# EAGLE design DAQ32 (EAGLE 5.10)
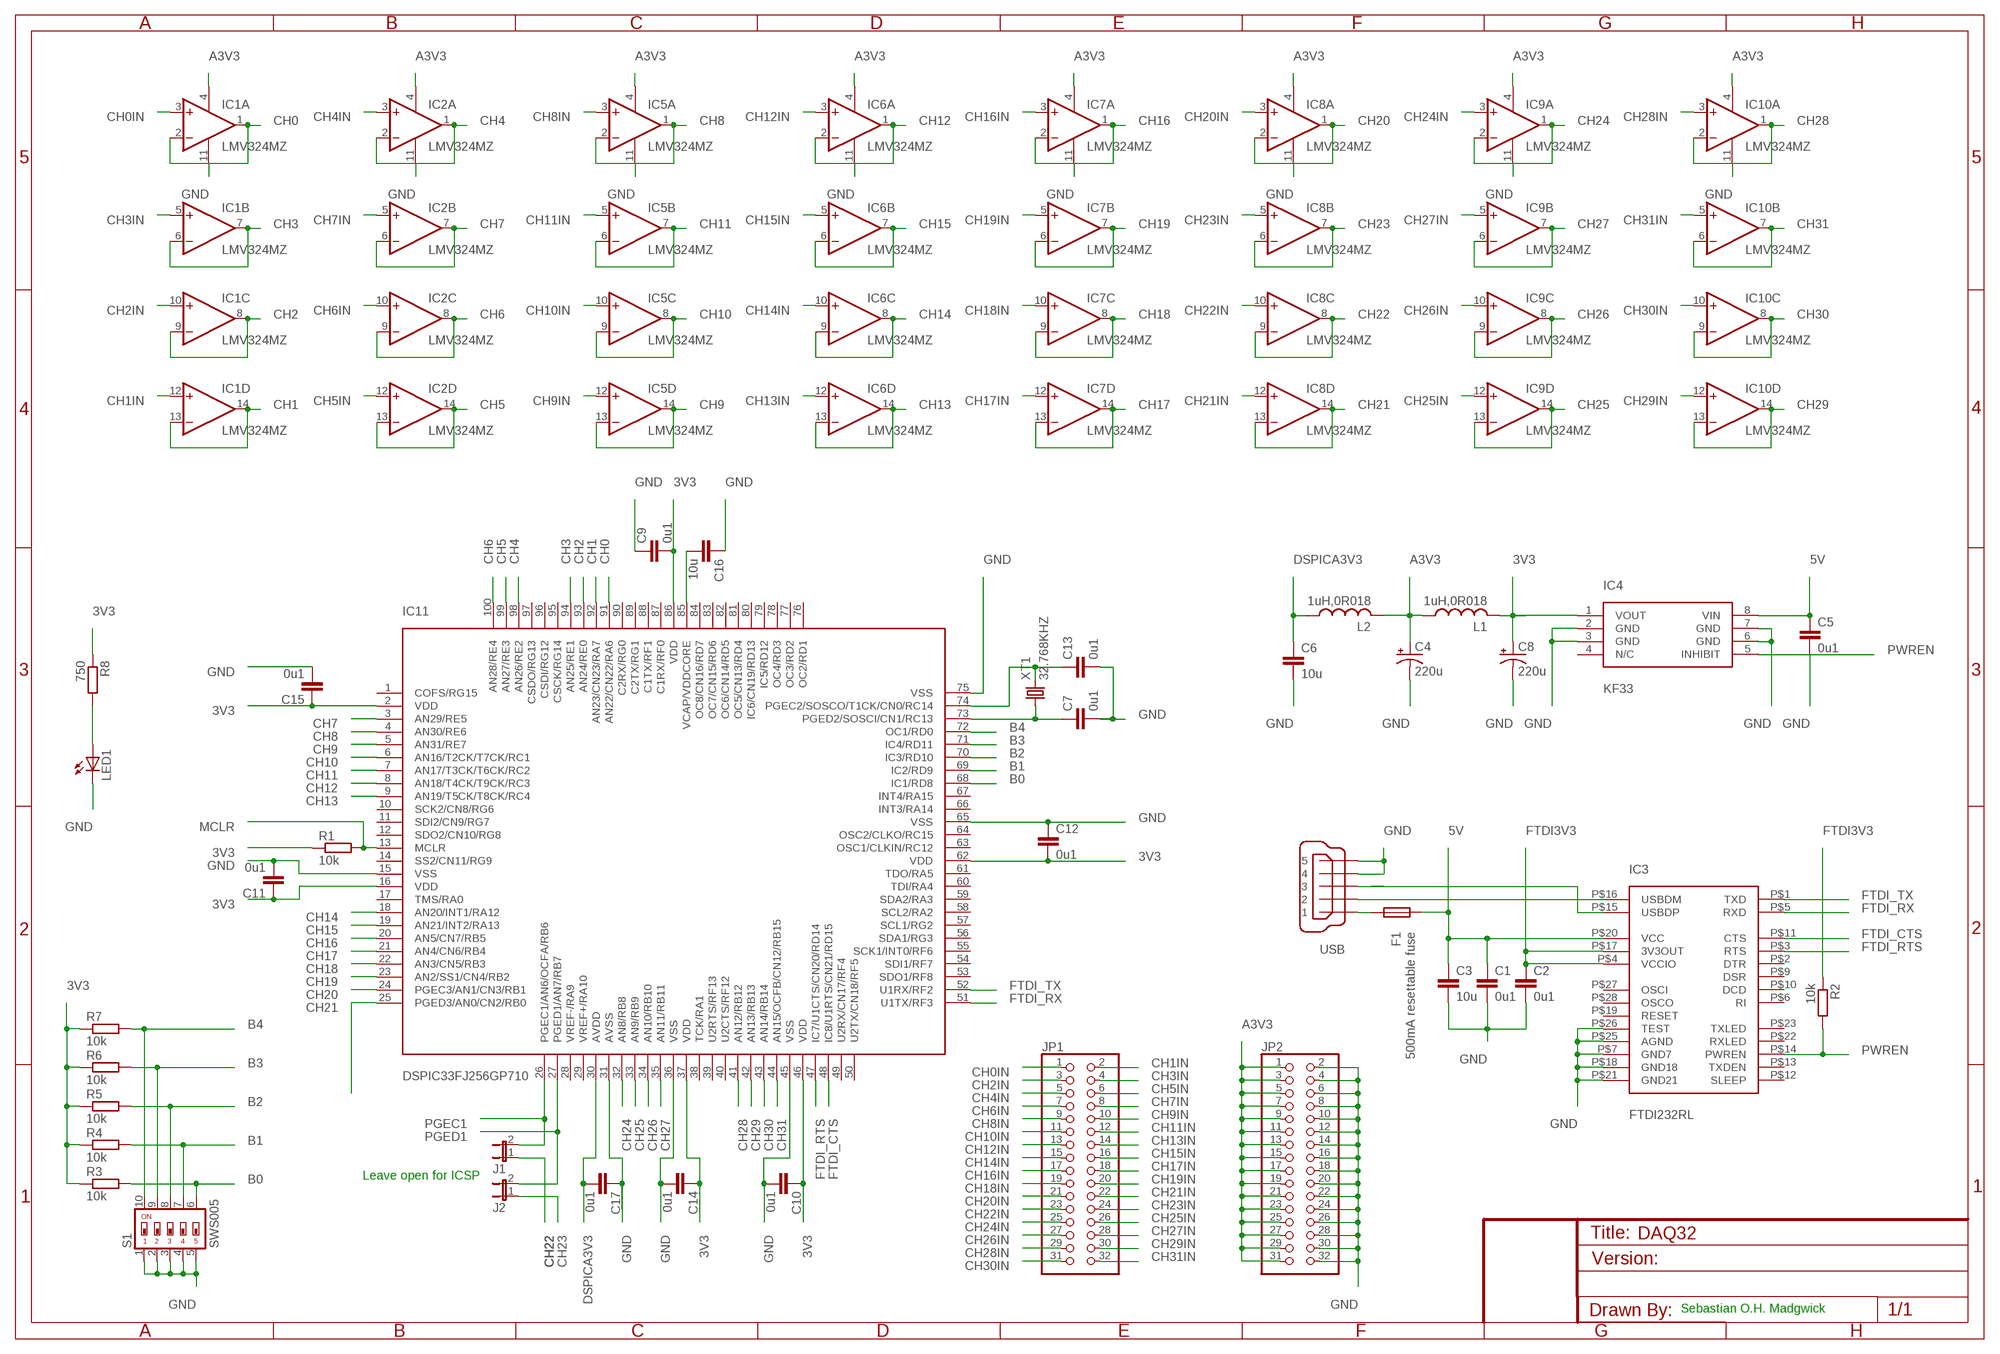
[diagram p0: schematic, sheet 1]

## Parts
C1  0u1  CAP0603-CAP  [0603-CAP]
C2  0u1  CAP0603-CAP  [0603-CAP]
C3  10u  CAP0603-CAP  [0603-CAP]
C4  220u  CPOL-USD  [PANASONIC_D]
C5  0u1  CAP0603-CAP  [0603-CAP]
C6  10u  CAP0603-CAP  [0603-CAP]
C7  0u1  CAP0603-CAP  [0603-CAP]
C8  220u  CPOL-USD  [PANASONIC_D]
C9  0u1  CAP0603-CAP  [0603-CAP]
C10  0u1  CAP0603-CAP  [0603-CAP]
C11  0u1  CAP0603-CAP  [0603-CAP]
C12  0u1  CAP0603-CAP  [0603-CAP]
C13  0u1  CAP0603-CAP  [0603-CAP]
C14  0u1  CAP0603-CAP  [0603-CAP]
C15  0u1  CAP0603-CAP  [0603-CAP]
C16  10u  CAP0603-CAP  [0603-CAP]
C17  0u1  CAP0603-CAP  [0603-CAP]
F1  500mA resettable fuse  R-EU_R1206  [R1206]
IC1  LMV324MZ  [TSSOP14]
IC2  LMV324MZ  [TSSOP14]
IC3  FTDI232RL  [SSOP28]
IC4  KF33  [SO-08]
IC5  LMV324MZ  [TSSOP14]
IC6  LMV324MZ  [TSSOP14]
IC7  LMV324MZ  [TSSOP14]
IC8  LMV324MZ  [TSSOP14]
IC9  LMV324MZ  [TSSOP14]
IC10  LMV324MZ  [TSSOP14]
IC11  DSPIC33FJ256GP710  [TQFP-100]
J1  JUMPER-2SMD-NO  [SJ_2S-NO]
J2  JUMPER-2SMD-NO  [SJ_2S-NO]
JP1  PINHD-2X16  [2X16]
JP2  PINHD-2X16  [2X16]
L1  1uH,0R018  L-USPIS2816  [PIS2816]
L2  1uH,0R018  L-USPIS2816  [PIS2816]
LED1  LEDCHIPLED_0603  [CHIPLED_0603]
R1  10k  R-EU_R0603  [R0603]
R2  10k  R-EU_R0603  [R0603]
R3  10k  R-EU_R0603  [R0603]
R4  10k  R-EU_R0603  [R0603]
R5  10k  R-EU_R0603  [R0603]
R6  10k  R-EU_R0603  [R0603]
R7  10k  R-EU_R0603  [R0603]
R8  750  R-EU_R0603  [R0603]
S1  SWS005  [SMS-005]
USB  MINI-USB-UX60A-MB-5ST  [UX60A-MB-5ST]
XT1  32.768KHZ  TUNINGFORKCRYSTAL32.768KHZ  [TUNINGFORKCRYSTAL32.768KHZ]

## Nets
3V3: C8.+ C9.2 C10.1 C11.1 C12.2 C14.1 C15.1 IC4.1(VOUT) IC11.2(VDD) IC11.16(VDD) IC11.37(VDD) IC11.46(VDD) IC11.62(VDD) IC11.86(VDD) L1.2 R1.1 R3.1 R4.1 R5.1 R6.1 R7.1 R8.1
5V: C1.1 C3.1 C5.1 F1.2 IC3.P$20(VCC) IC4.8(VIN)
A3V3: C4.+ IC1.4(P:V+) IC2.4(P:V+) IC5.4(P:V+) IC6.4(P:V+) IC7.4(P:V+) IC8.4(P:V+) IC9.4(P:V+) IC10.4(P:V+) JP2.1 JP2.3 JP2.5 JP2.7 JP2.9 JP2.11 JP2.13 JP2.15 JP2.17 JP2.19 JP2.21 JP2.23 JP2.25 JP2.27 JP2.29 JP2.31 L1.1 L2.2
B0: IC11.68(IC1/RD8) R3.2 S1.6
B1: IC11.69(IC2/RD9) R4.2 S1.7
B2: IC11.70(IC3/RD10) R5.2 S1.8
B3: IC11.71(IC4/RD11) R6.2 S1.9
B4: IC11.72(OC1/RD0) R7.2 S1.10
CH0: IC1.1(A:OUT) IC1.2(A:-IN) IC11.91(AN22/CN22/RA6)
CH0IN: IC1.3(A:+IN) JP1.1
CH1: IC1.13(D:-IN) IC1.14(D:OUT) IC11.92(AN23/CN23/RA7)
CH1IN: IC1.12(D:+IN) JP1.2
CH2: IC1.8(C:OUT) IC1.9(C:-IN) IC11.93(AN24/RE0)
CH2IN: IC1.10(C:+IN) JP1.3
CH3: IC1.6(B:-IN) IC1.7(B:OUT) IC11.94(AN25/RE1)
CH3IN: IC1.5(B:+IN) JP1.4
CH4: IC2.1(A:OUT) IC2.2(A:-IN) IC11.98(AN26/RE2)
CH4IN: IC2.3(A:+IN) JP1.5
CH5: IC2.13(D:-IN) IC2.14(D:OUT) IC11.99(AN27/RE3)
CH5IN: IC2.12(D:+IN) JP1.6
CH6: IC2.8(C:OUT) IC2.9(C:-IN) IC11.100(AN28/RE4)
CH6IN: IC2.10(C:+IN) JP1.7
CH7: IC2.6(B:-IN) IC2.7(B:OUT) IC11.3(AN29/RE5)
CH7IN: IC2.5(B:+IN) JP1.8
CH8: IC5.1(A:OUT) IC5.2(A:-IN) IC11.4(AN30/RE6)
CH8IN: IC5.3(A:+IN) JP1.9
CH9: IC5.13(D:-IN) IC5.14(D:OUT) IC11.5(AN31/RE7)
CH9IN: IC5.12(D:+IN) JP1.10
CH10: IC5.8(C:OUT) IC5.9(C:-IN) IC11.6(AN16/T2CK/T7CK/RC1)
CH10IN: IC5.10(C:+IN) JP1.11
CH11: IC5.6(B:-IN) IC5.7(B:OUT) IC11.7(AN17/T3CK/T6CK/RC2)
CH11IN: IC5.5(B:+IN) JP1.12
CH12: IC6.1(A:OUT) IC6.2(A:-IN) IC11.8(AN18/T4CK/T9CK/RC3)
CH12IN: IC6.3(A:+IN) JP1.13
CH13: IC6.13(D:-IN) IC6.14(D:OUT) IC11.9(AN19/T5CK/T8CK/RC4)
CH13IN: IC6.12(D:+IN) JP1.14
CH14: IC6.8(C:OUT) IC6.9(C:-IN) IC11.18(AN20/INT1/RA12)
CH14IN: IC6.10(C:+IN) JP1.15
CH15: IC6.6(B:-IN) IC6.7(B:OUT) IC11.19(AN21/INT2/RA13)
CH15IN: IC6.5(B:+IN) JP1.16
CH16: IC7.1(A:OUT) IC7.2(A:-IN) IC11.20(AN5/CN7/RB5)
CH16IN: IC7.3(A:+IN) JP1.17
CH17: IC7.13(D:-IN) IC7.14(D:OUT) IC11.21(AN4/CN6/RB4)
CH17IN: IC7.12(D:+IN) JP1.18
CH18: IC7.8(C:OUT) IC7.9(C:-IN) IC11.22(AN3/CN5/RB3)
CH18IN: IC7.10(C:+IN) JP1.19
CH19: IC7.6(B:-IN) IC7.7(B:OUT) IC11.23(AN2/SS1/CN4/RB2)
CH19IN: IC7.5(B:+IN) JP1.20
CH20: IC8.1(A:OUT) IC8.2(A:-IN) IC11.24(PGEC3/AN1/CN3/RB1)
CH20IN: IC8.3(A:+IN) JP1.21
CH21: IC8.13(D:-IN) IC8.14(D:OUT) IC11.25(PGED3/AN0/CN2/RB0)
CH21IN: IC8.12(D:+IN) JP1.22
CH22: IC8.8(C:OUT) IC8.9(C:-IN) J1.1
CH22IN: IC8.10(C:+IN) JP1.23
CH23: IC8.6(B:-IN) IC8.7(B:OUT) J2.1
CH23IN: IC8.5(B:+IN) JP1.24
CH24: IC9.1(A:OUT) IC9.2(A:-IN) IC11.32(AN8/RB8)
CH24IN: IC9.3(A:+IN) JP1.25
CH25: IC9.13(D:-IN) IC9.14(D:OUT) IC11.33(AN9/RB9)
CH25IN: IC9.12(D:+IN) JP1.26
CH26: IC9.8(C:OUT) IC9.9(C:-IN) IC11.34(AN10/RB10)
CH26IN: IC9.10(C:+IN) JP1.27
CH27: IC9.6(B:-IN) IC9.7(B:OUT) IC11.35(AN11/RB11)
CH27IN: IC9.5(B:+IN) JP1.28
CH28: IC10.1(A:OUT) IC10.2(A:-IN) IC11.41(AN12/RB12)
CH28IN: IC10.3(A:+IN) JP1.29
CH29: IC10.13(D:-IN) IC10.14(D:OUT) IC11.42(AN13/RB13)
CH29IN: IC10.12(D:+IN) JP1.30
CH30: IC10.8(C:OUT) IC10.9(C:-IN) IC11.43(AN14/RB14)
CH30IN: IC10.10(C:+IN) JP1.31
CH31: IC10.6(B:-IN) IC10.7(B:OUT) IC11.44(AN15/OCFB/CN12/RB15)
CH31IN: IC10.5(B:+IN) JP1.32
D+: IC3.P$15(USBDP) USB.3
D-: IC3.P$16(USBDM) USB.2
DSPICA3V3: C6.1 C17.2 IC11.30(AVDD) L2.1
FTDI3V3: C2.1 IC3.P$4(VCCIO) IC3.P$17(3V3OUT) R2.1
FTDI_CTS: IC3.P$11(CTS) IC11.48(IC8/U1RTS/CN21/RD15)
FTDI_RTS: IC3.P$3(RTS) IC11.47(IC7/U1CTS/CN20/RD14)
FTDI_RX: IC3.P$5(RXD) IC11.51(U1TX/RF3)
FTDI_TX: IC3.P$1(TXD) IC11.52(U1RX/RF2)
GND: C1.2 C2.2 C3.2 C4.- C5.2 C6.2 C7.2 C8.- C9.1 C10.2 C11.2 C12.1 C13.2 C14.2 C15.2 C16.1 C17.1 IC1.11(P:V-) IC2.11(P:V-) IC3.P$7(GND7) IC3.P$18(GND18) IC3.P$21(GND21) IC3.P$25(AGND) IC3.P$26(TEST) IC4.2(GND) IC4.3(GND) IC4.6(GND) IC4.7(GND) IC5.11(P:V-) IC6.11(P:V-) IC7.11(P:V-) IC8.11(P:V-) IC9.11(P:V-) IC10.11(P:V-) IC11.15(VSS) IC11.31(AVSS) IC11.36(VSS) IC11.45(VSS) IC11.65(VSS) IC11.75(VSS) JP2.2 JP2.4 JP2.6 JP2.8 JP2.10 JP2.12 JP2.14 JP2.16 JP2.18 JP2.20 JP2.22 JP2.24 JP2.26 JP2.28 JP2.30 JP2.32 LED1.C S1.1 S1.2 S1.3 S1.4 S1.5 USB.4 USB.5
MCLR: IC11.13(MCLR) R1.2
N$2: F1.1 USB.1
N$3: LED1.A R8.2
N$15: C16.2 IC11.85(VCAP/VDDCORE)
N$17: C13.1 IC11.74(PGEC2/SOSCO/T1CK/CN0/RC14) XT1.P$2
N$18: C7.1 IC11.73(PGED2/SOSCI/CN1/RC13) XT1.P$1
PGEC1: IC11.26(PGEC1/AN6/OCFA/RB6) J1.2
PGED1: IC11.27(PGED1/AN7/RB7) J2.2
PWREN: IC3.P$14(PWREN) IC4.5(INHIBIT) R2.2
Unconnected: IC3.P$2(DTR) IC3.P$6(RI) IC3.P$9(DSR) IC3.P$10(DCD) IC3.P$12(SLEEP) IC3.P$13(TXDEN) IC3.P$19(RESET) IC3.P$22(RXLED) IC3.P$23(TXLED) IC3.P$27(OSCI) IC3.P$28(OSCO) IC4.4(N/C) IC11.1(COFS/RG15) IC11.10(SCK2/CN8/RG6) IC11.11(SDI2/CN9/RG7) IC11.12(SDO2/CN10/RG8) IC11.14(SS2/CN11/RG9) IC11.17(TMS/RA0) IC11.28(VREF-/RA9) IC11.29(VREF+/RA10) IC11.38(TCK/RA1) IC11.39(U2RTS/RF13) IC11.40(U2CTS/RF12) IC11.49(U2RX/CN17/RF4) IC11.50(U2TX/CN18/RF5) IC11.53(SDO1/RF8) IC11.54(SDI1/RF7) IC11.55(SCK1/INT0/RF6) IC11.56(SDA1/RG3) IC11.57(SCL1/RG2) IC11.58(SCL2/RA2) IC11.59(SDA2/RA3) IC11.60(TDI/RA4) IC11.61(TDO/RA5) IC11.63(OSC1/CLKIN/RC12) IC11.64(OSC2/CLKO/RC15) IC11.66(INT3/RA14) IC11.67(INT4/RA15) IC11.76(OC2/RD1) IC11.77(OC3/RD2) IC11.78(OC4/RD3) IC11.79(IC5/RD12) IC11.80(IC6/CN19/RD13) IC11.81(OC5/CN13/RD4) IC11.82(OC6/CN14/RD5) IC11.83(OC7/CN15/RD6) IC11.84(OC8/CN16/RD7) IC11.87(C1RX/RF0) IC11.88(C1TX/RF1) IC11.89(C2TX/RG1) IC11.90(C2RX/RG0) IC11.95(CSCK/RG14) IC11.96(CSDI/RG12) IC11.97(CSDO/RG13)

## Notes on the sheet
- Leave open for ICSP
- Sebastian O.H. Madgwick

## Library data of the parts
C1-C3 C5-C7 C9-C17 = SparkFun:CAP: Capacitor Standard 0603 ceramic capacitor, and 0.1" leaded capacitor.
C4 C8 = rcl:CPOL-US: POLARIZED CAPACITOR, American symbol
F1 R1-R8 = rcl:R-EU_: RESISTOR, European symbol
IC1 IC2 IC5-IC10 = linear:LMV324?*: Quad General Purpose, Low Voltage, Rail-to-Rail Output Operational Amplifiers Source: http://www.national.com/mpf/LM/LMV321.html http://www.national.com/dt/lmv_qual.pdf
IC3 = miscMODIFIED:FTDI232RL
IC4 = v-regMODIFED:KF33
IC11 = 33fj256xx710:DSPIC33FJ256GP710
J1 J2 = SparkFun:JUMPER-2: Jumper Basic 0.1" spaced jumper. Use with breakaway headers.
JP1 JP2 = pinhead:PINHD-2X16: PIN HEADER
L1 L2 = rcl:L-US: INDUCTOR, American symbol
LED1 = led:LED: LED OSRAM: - CHIPLED LG R971, LG N971, LY N971, LG Q971, LY Q971, LO R971, LY R971 LH N974, LH R974 LS Q976, LO Q976, LY Q976 LO Q996 - Hyper CHIPLED LW Q18S LB Q993, LB Q99A, LB R99A - SideLED LS A670, LO A670, LY A670, LG A670, LP A670 LB A673, LV A673, LT A673, LW A673 LH A674 LY A675 LS A676, LA A676, LO A676, LY A676, LW A676 LS A679, LY A679, LG A679 - Hyper Micro SIDELED® LS Y876, LA Y876, LO Y876, LY Y876 LT Y87S - SmartLED LW L88C, LW L88S LB L89C, LB L89S, LG L890 LS L89K, LO L89K, LY L89K LS L896, LA L896, LO L896, LY L896 - TOPLED LS T670, LO T670, LY T670, LG T670, LP T670 LSG T670, LSP T670, LSY T670, LOP T670, LYG T670 LG T671, LOG T671, LSG T671 LB T673, LV T673, LT T673, LW T673 LH T674 LS T676, LA T676, LO T676, LY T676, LB T676, LH T676, LSB T676, LW T676 LB T67C, LV T67C, LT T67C, LS T67K, LO T67K, LY T67K, LW E67C LS E67B, LA E67B, LO E67B, LY E67B, LB E67C, LV E67C, LT E67C LW T67C LS T679, LY T679, LG T679 LS T770, LO T770, LY T770, LG T770, LP T770 LB T773, LV T773, LT T773, LW T773 LH T774 LS E675, LA E675, LY E675, LS T675 LS T776, LA T776, LO T776, LY T776, LB T776 LHGB T686 LT T68C, LB T68C - Hyper Mini TOPLED® LB M676 - Mini TOPLED Santana® LG M470 LS M47K, LO M47K, LY M47K Source: http://www.osram.convergy.de - LUMILED® LXK2-PW12-R00, LXK2-PW12-S00, LXK2-PW14-U00, LXK2-PW14-V00 LXK2-PM12-R00, LXK2-PM12-S00, LXK2-PM14-U00 LXK2-PE12-Q00, LXK2-PE12-R00, LXK2-PE12-S00, LXK2-PE14-T00, LXK2-PE14-U00 LXK2-PB12-K00, LXK2-PB12-L00, LXK2-PB12-M00, LXK2-PB14-N00, LXK2-PB14-P00, LXK2-PB14-Q00 LXK2-PR12-L00, LXK2-PR12-M00, LXK2-PR14-Q00, LXK2-PR14-R00 LXK2-PD12-Q00, LXK2-PD12-R00, LXK2-PD12-S00 LXK2-PH12-R00, LXK2-PH12-S00 LXK2-PL12-P00, LXK2-PL12-Q00, LXK2-PL12-R00 Source: www.luxeon.com
S1 = smd-special:SWS005: SMD Dip Switch 5 pol.
USB = con-hiroseMODIFIED:MINI-USB-: MINI USB Connector Source: http://www.hirose.co.jp/cataloge_hp/e24000019.pdf
XT1 = crystalMODIFIED:TUNINGFORKCRYSTAL32.768KHZ

## Board
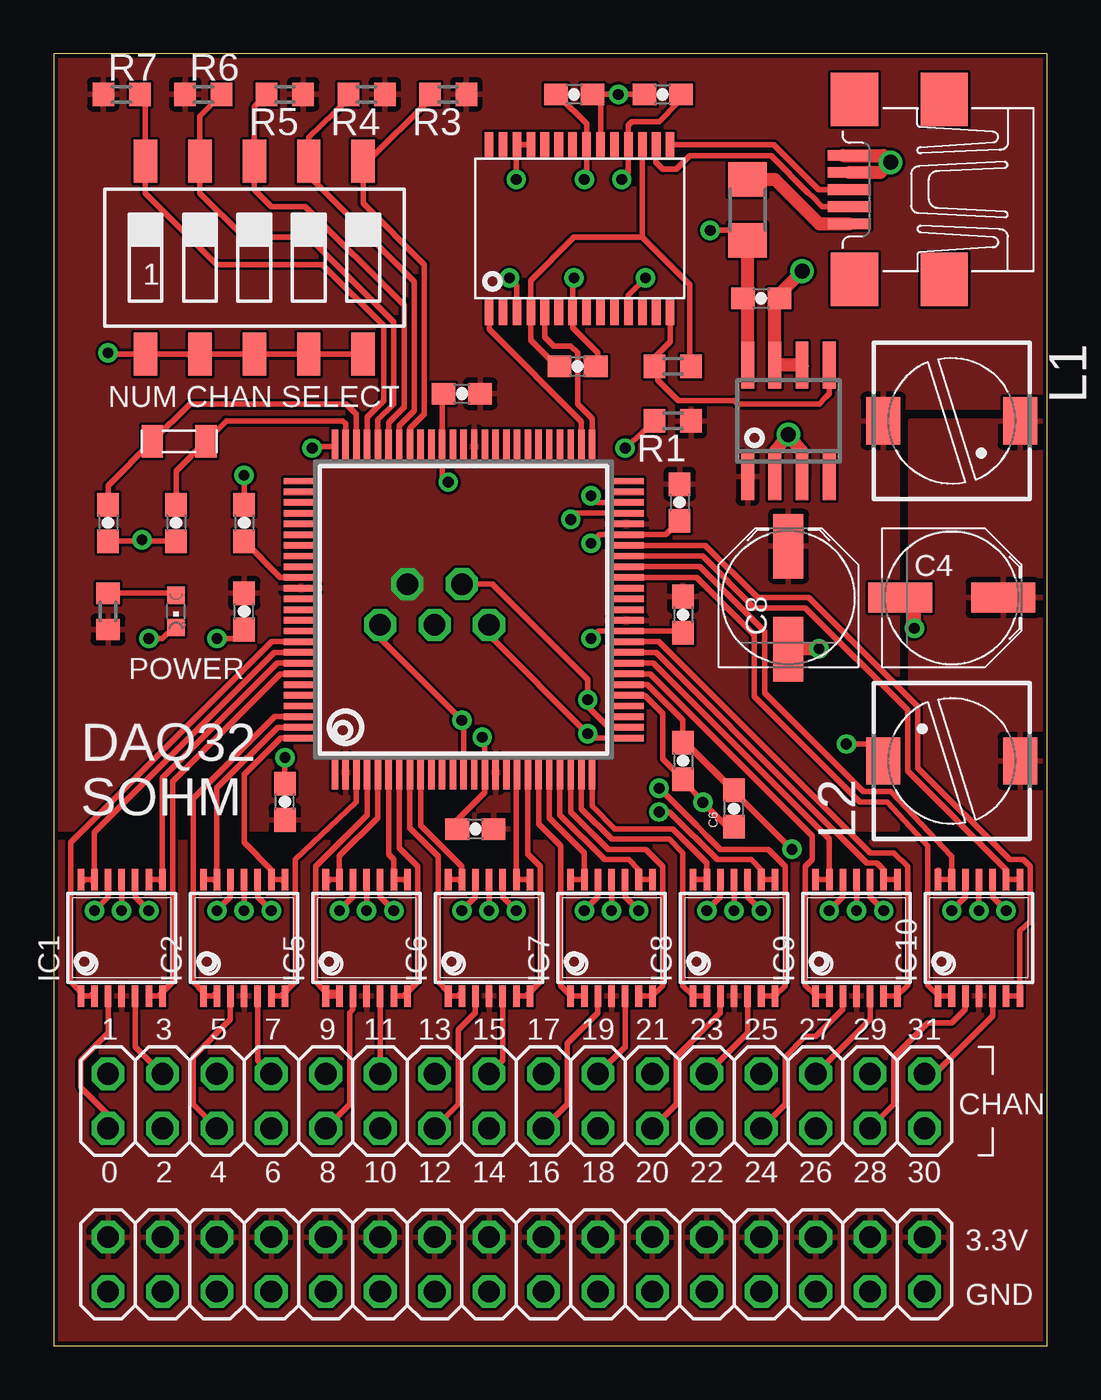
[diagram p1: board, top side]
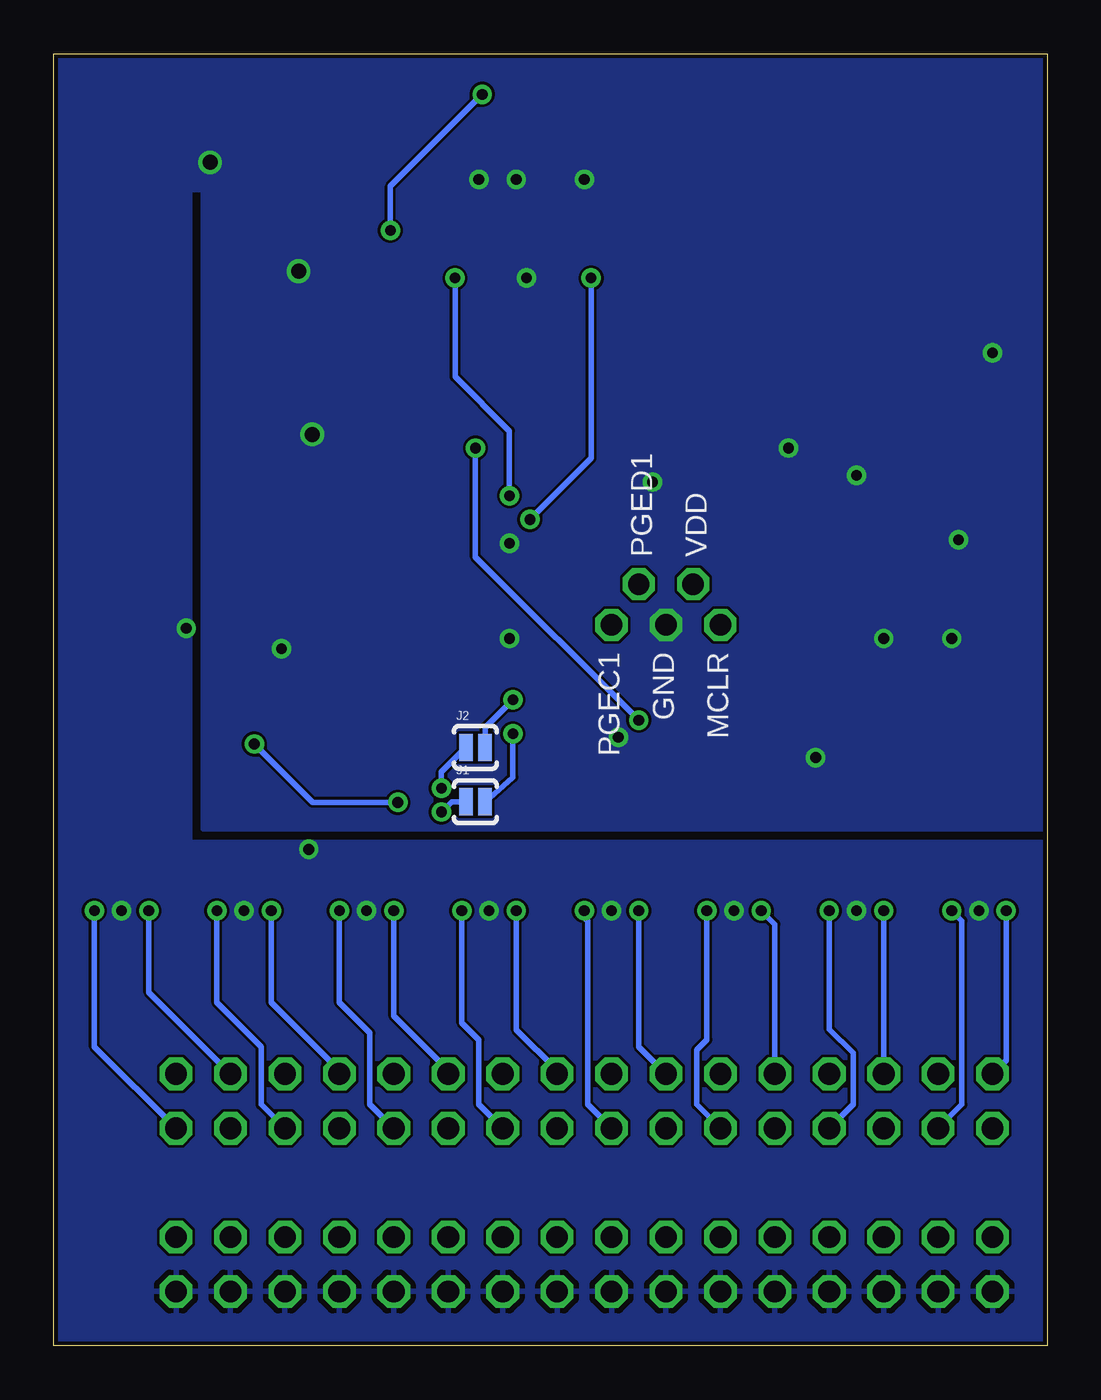
[diagram p2: board, bottom side, seen from below]

Size 46.35 x 60.33 mm. Coordinates in mm from the lower left corner, seen from the top.
Outline: 0,0 46.35,0 46.35,60.33 0,60.33 0,0
Copper layers (1*16): Top 0.035mm / dielectric 1.5mm / Bottom 0.035mm
Design rules "default *": minimum track width 5mil, minimum drill 15mil, track to track 5mil, track to pad 5mil, pad to pad 5mil, via to via 5mil, smd to smd 5mil, copper to edge 0.2mm, drill to drill 0.15mm, minimum pad ring 10mil, minimum via ring 8mil, stop-mask expansion 4mil, vias tented up to drill 1mm, thermal gap 10mil

### Footprints (pad centres in the part's own frame; a part is rotated, then mirrored left to right if it is on the bottom)
0603-CAP = smd 1.1 x 1: 1 -0.85,0; 2 0.85,0
PANASONIC_D = smd 3 x 1.4: + 2.4,0; - -2.4,0
R1206 = smd 1.6 x 1.803: 1 -1.422,0; 2 1.422,0
TSSOP14 = smd 0.305 x 0.991: 1 -1.905,-2.718; 2 -1.27,-2.718; 3 -0.635,-2.718; 4 0,-2.718; 5 0.635,-2.718; 6 1.27,-2.718; 7 1.905,-2.718; 8 1.905,2.718; 9 1.27,2.718; 10 0.635,2.718; 11 0,2.718; 12 -0.635,2.718; 13 -1.27,2.718; 14 -1.905,2.718
SSOP28 = smd 1.2 x 0.4: P$1 0,0; P$2 0,-0.65; P$3 0,-1.3; P$4 0,-1.95; P$5 0,-2.6; P$6 0,-3.25; P$7 0,-3.9; P$8 0,-4.55; P$9 0,-5.2; P$10 0,-5.85; P$11 0,-6.5; P$12 0,-7.15; P$13 0,-7.8; P$14 0,-8.45; P$15 7.8,-8.45; P$16 7.8,-7.8; P$17 7.8,-7.15; P$18 7.8,-6.5; P$19 7.8,-5.85; P$20 7.8,-5.2; P$21 7.8,-4.55; P$22 7.8,-3.9; P$23 7.8,-3.25; P$24 7.8,-2.6; P$25 7.8,-1.95; P$26 7.8,-1.3; P$27 7.8,-0.65; P$28 7.8,0
SO-08 = smd 0.6 x 2.2: 1 -1.905,-2.6; 2 -0.635,-2.6; 3 0.635,-2.6; 4 1.905,-2.6; 5 1.905,2.6; 6 0.635,2.6; 7 -0.635,2.6; 8 -1.905,2.6
TQFP-100 = smd 1.6 x 0.3: 1 -7.52,5.92; 2 -7.52,5.42; 3 -7.52,4.92; 4 -7.52,4.42; 5 -7.52,3.92; 6 -7.52,3.42; 7 -7.52,2.92; 8 -7.52,2.42; 9 -7.52,1.92; 10 -7.52,1.42; 11 -7.52,0.92; 12 -7.52,0.42; 13 -7.52,-0.08; 14 -7.52,-0.58; 15 -7.52,-1.08; 16 -7.52,-1.58; 17 -7.52,-2.08; 18 -7.52,-2.58; 19 -7.52,-3.08; 20 -7.52,-3.58; 21 -7.52,-4.08; 22 -7.52,-4.58; 23 -7.52,-5.08; 24 -7.52,-5.58; 25 -7.52,-6.08; 51 7.68,-6.08; 52 7.68,-5.58; 53 7.68,-5.08; 54 7.68,-4.58; 55 7.68,-4.08; 56 7.68,-3.58; 57 7.68,-3.08; 58 7.68,-2.58; 59 7.68,-2.08; 60 7.68,-1.58; 61 7.68,-1.08; 62 7.68,-0.58; 63 7.68,-0.08; 64 7.68,0.42; 65 7.68,0.92; 66 7.68,1.42; 67 7.68,1.92; 68 7.68,2.42; 69 7.68,2.92; 70 7.68,3.42; 71 7.68,3.92; 72 7.68,4.42; 73 7.68,4.92; 74 7.68,5.42; 75 7.68,5.92 | smd 0.3 x 1.6: 26 -5.92,-7.68; 27 -5.42,-7.68; 28 -4.92,-7.68; 29 -4.42,-7.68; 30 -3.92,-7.68; 31 -3.42,-7.68; 32 -2.92,-7.68; 33 -2.42,-7.68; 34 -1.92,-7.68; 35 -1.42,-7.68; 36 -0.92,-7.68; 37 -0.42,-7.68; 38 0.08,-7.68; 39 0.58,-7.68; 40 1.08,-7.68; 41 1.58,-7.68; 42 2.08,-7.68; 43 2.58,-7.68; 44 3.08,-7.68; 45 3.58,-7.68; 46 4.08,-7.68; 47 4.58,-7.68; 48 5.08,-7.68; 49 5.58,-7.68; 50 6.08,-7.68; 76 6.08,7.52; 77 5.58,7.52; 78 5.08,7.52; 79 4.58,7.52; 80 4.08,7.52; 81 3.58,7.52; 82 3.08,7.52; 83 2.58,7.52; 84 2.08,7.52; 85 1.58,7.52; 86 1.08,7.52; 87 0.58,7.52; 88 0.08,7.52; 89 -0.42,7.52; 90 -0.92,7.52; 91 -1.42,7.52; 92 -1.92,7.52; 93 -2.42,7.52; 94 -2.92,7.52; 95 -3.42,7.52; 96 -3.92,7.52; 97 -4.42,7.52; 98 -4.92,7.52; 99 -5.42,7.52; 100 -5.92,7.52
SJ_2S-NO = smd 0.635 x 1.27: 1 -0.45,0; 2 0.45,0
2X16 = drill 1.016 octagon: 1 -19.05,-1.27; 2 -19.05,1.27; 3 -16.51,-1.27; 4 -16.51,1.27; 5 -13.97,-1.27; 6 -13.97,1.27; 7 -11.43,-1.27; 8 -11.43,1.27; 9 -8.89,-1.27; 10 -8.89,1.27; 11 -6.35,-1.27; 12 -6.35,1.27; 13 -3.81,-1.27; 14 -3.81,1.27; 15 -1.27,-1.27; 16 -1.27,1.27; 17 1.27,-1.27; 18 1.27,1.27; 19 3.81,-1.27; 20 3.81,1.27; 21 6.35,-1.27; 22 6.35,1.27; 23 8.89,-1.27; 24 8.89,1.27; 25 11.43,-1.27; 26 11.43,1.27; 27 13.97,-1.27; 28 13.97,1.27; 29 16.51,-1.27; 30 16.51,1.27; 31 19.05,-1.27; 32 19.05,1.27
PIS2816 = smd 2.2 x 1.6: 1 0,3.2; 2 0,-3.2
CHIPLED_0603 = smd 0.8 x 0.8: A 0,-0.75; C 0,0.75
R0603 = smd 1 x 1.1: 1 -0.85,0; 2 0.85,0
SMS-005 = smd 1.092 x 2.007: 1 -5.08,-4.496; 2 -2.54,-4.496; 3 0,-4.496; 4 2.54,-4.496; 5 5.08,-4.496; 6 5.08,4.496; 7 2.54,4.496; 8 0,4.496; 9 -2.54,4.496; 10 -5.08,4.496
UX60A-MB-5ST = smd 2 x 0.5: 1 2.25,1.6; 2 2.25,0.8; 3 2.25,0; 4 2.25,-0.8; 5 2.25,-1.6 | smd 2.2 x 2.5: M1 -2.189,-4.2; M2 -2.189,4.2; M3 2,4.2; M4 2,-4.2
TUNINGFORKCRYSTAL32.768KHZ = smd 1 x 1.5: P$1 0,0; P$2 2.5,0

### Placement (x,y rotation side)
C1  24.29,58.42 180 top
C2  24.45,45.72 0 top
C3  28.42,58.42 0 top
C4  41.91,34.92 0 top
C5  33.02,48.9 0 top
C6  31.75,25.08 90 top
C7  2.54,38.42 270 top
C8  34.29,34.92 90 top
C9  8.89,34.29 90 top
C10  29.21,39.37 270 top
C11  19.68,24.13 180 top
C12  19.05,44.45 0 top
C13  5.72,38.42 270 top
C14  29.37,34.13 270 top
C15  10.79,25.4 90 top
C16  8.89,38.42 270 top
C17  29.37,27.3 270 top
F1  32.38,53.02 270 top
IC1  3.17,19.05 0 top
IC2  8.89,19.05 0 top
IC3  20.32,48.26 90 top
IC4  34.29,43.18 0 top
IC5  14.61,19.05 0 top
IC6  20.32,19.05 0 top
IC7  26.04,19.05 0 top
IC8  31.75,19.05 0 top
IC9  37.47,19.05 0 top
IC10  43.18,19.05 0 top
IC11  19.05,34.29 90 top
J1  26.67,25.4 0 bottom
J2  26.67,27.94 0 bottom
JP1  21.59,11.43 0 top
JP2  21.59,3.81 180 top
L1  41.91,43.18 270 top
L2  41.91,27.3 90 top
LED1  5.71,34.29 180 top
R1  28.89,43.18 180 top
R2  28.89,45.72 180 top
R3  18.41,58.42 180 top
R4  14.61,58.42 180 top
R5  10.79,58.42 180 top
R6  6.99,58.42 0 top
R7  3.17,58.42 0 top
R8  2.54,34.29 90 top
S1  9.37,50.8 0 top
USB  39.37,53.98 180 top
XT1  4.6,42.23 0 top

### Tracks (layer width: path | path; a pad name or v marks a point on that pad's centre or on a via)
3V3  (via drill 1)
  other vias: 16.51,35.56
  pour Top: 0,60.33 46.35,60.33 46.35,43.81 39.37,43.81 39.37,24.13 0,24.13
5V  (via drill 0.5)
  Top 0.254: 25.4,58.42 C1.1 25.3,58.2 25.52,57.98 | C3.1 v26.35,58.42 25.4,58.42 | 25.52,57.98 IC3.P$20 | 25.52,57.98 25.52,58.3 25.4,58.42 | F1.2 32.38,51.75 32.07,52.07 v30.64,52.07
  Top 0.61: 32.38,48.9 C5.1 | IC4.8 32.38,48.9 | 32.38,48.9 F1.2
  Bottom 0.254: v30.64,52.07 30.64,54.13 v26.35,58.42
A3V3
  pour Top: 46.35,43.18 40.01,43.18 40.01,23.5 0,23.5 0,0 46.35,0
B0
  Top 0.254: IC11.68 16.63,42.82 17.3,43.5 17.3,50.48 14.45,53.34 S1.6 | S1.6 | R3.2 17.57,58.2 14.61,55.24 14.55,55.3 S1.6
B1
  Top 0.254: IC11.69 16.13,42.96 16.83,43.66 16.83,49.69 12.06,54.45 12.06,55.14 S1.7 11.91,56.41 13.65,58.1 13.65,58.42 R4.2
B2
  Top 0.254: IC11.70 15.63,43.09 16.35,43.81 16.35,48.58 11.75,53.18 10.16,53.18 9.37,53.98 S1.8 9.37,57.84 R5.2
B3
  Top 0.254: IC11.71 15.13,43.23 15.88,43.97 15.88,47.78 11.91,51.75 8.89,51.75 6.83,53.82 S1.9 6.83,57.41 R6.2
B4
  Top 0.254: IC11.72 14.63,43.36 15.4,44.13 15.4,47.62 12.54,50.48 7.62,50.48 4.29,53.82 S1.10 4.29,58.16 R7.2
CH0
  Top 0.254: IC11.91 10.17,32.87 0.79,23.5 0.79,16.99 1.27,16.51 IC1.1 1.73,16.33 1.91,16.51 IC1.2
CH0IN
  Top 0.254: JP1.1 2.54,10.79 1.27,12.06 1.27,13.34 2.54,14.61 IC1.3 2.54,16.51
CH1
  Top 0.254: IC1.13 1.91,21.59 1.73,21.77 IC1.14 | IC1.13 1.45,21.77 1.27,21.59 | IC11.92 10.3,32.37 1.91,23.97 IC1.13
CH1IN  (via drill 0.5)
  Top 0.254: IC1.12 2.54,20.95 v1.91,20.32
  Bottom 0.254: v1.91,20.32 1.91,13.34 JP1.2
CH2
  Top 0.254: IC1.9 4.9,21.77 5.08,21.59 | IC11.93 10.44,31.87 5.08,26.51 5.08,21.59 | 5.08,21.59 IC1.8
CH2IN  (via drill 0.5)
  Top 0.254: IC1.10 3.81,20.95 v4.45,20.32
  Bottom 0.254: v4.45,20.32 3.97,19.84 3.97,11.27 JP1.3
CH3
  Top 0.254: IC1.6 4.9,16.33 5.08,16.51 | IC11.94 10.57,31.37 5.56,26.35 5.56,16.99 5.08,16.51 | 5.08,16.51 IC1.7
CH3IN
  Top 0.254: IC1.5 3.81,13.97 JP1.4
CH4
  Top 0.254: IC2.2 7.62,16.51 7.44,16.33 IC2.1 6.99,16.51 6.51,16.99 6.51,25.56 10.32,29.37 IC11.98
CH4IN
  Top 0.254: JP1.5 6.51,11.27 6.51,13.49 8.26,15.24 IC2.3 8.26,16.51
CH5
  Top 0.254: IC11.99 10.46,28.87 7.62,26.04 IC2.13 7.62,21.59 7.44,21.77 IC2.14 6.99,21.59
CH5IN  (via drill 0.5)
  Top 0.254: IC2.12 8.26,20.95 v7.62,20.32
  Bottom 0.254: JP1.6 v7.62,20.32
CH6
  Top 0.254: IC2.8 10.79,21.59 10.62,21.77 IC2.9 | IC11.100 10.59,28.37 8.89,26.67 8.89,23.5 10.16,22.23 IC2.9 | IC2.9 10.16,21.59
CH6IN  (via drill 0.5)
  Top 0.254: IC2.10 9.53,20.95 v10.16,20.32
  Bottom 0.254: JP1.7 9.05,11.27 9.05,13.67 10.16,14.78 v10.16,20.32
CH7
  Top 0.254: 10.79,16.51 IC2.7 | IC2.6 10.62,16.33 10.79,16.51 | 10.79,16.51 11.27,16.99 11.27,22.7 14.13,25.4 IC11.3
CH7IN
  Top 0.254: IC2.5 9.53,13.34 JP1.8
CH8
  Top 0.254: 13.34,16.51 IC5.2 | IC5.1 13.16,16.33 13.34,16.51 | 13.34,16.51 12.7,16.51 12.22,16.99 12.22,22.38 14.63,24.79 IC11.4
CH8IN
  Top 0.254: JP1.9 13.81,11.27 13.81,15.56 13.97,15.72 IC5.3 13.97,16.51
CH9
  Top 0.254: IC5.14 12.7,21.59 12.88,21.77 IC5.13 13.34,22.86 15.13,24.66 IC11.5
CH9IN  (via drill 0.5)
  Top 0.254: IC5.12 13.97,20.95 v13.34,20.32
  Bottom 0.254: v13.34,20.32 12.7,19.68 JP1.10
CH10
  Top 0.254: IC5.8 16.51,21.59 16.33,21.77 IC5.9 15.88,22.7 15.63,22.95 IC11.6
CH10IN  (via drill 0.5)
  Top 0.254: IC5.10 15.24,20.95 v15.88,20.32
  Bottom 0.254: JP1.11 16.35,11.27 16.35,13.81 15.88,14.29 v15.88,20.32
CH11
  Top 0.254: IC5.6 16.33,16.33 16.51,16.51 | IC11.7 16.13,23.24 16.99,22.38 | 16.99,22.38 | 16.99,22.38 16.99,16.99 16.83,16.83 16.51,16.51 | 16.51,16.51 IC5.7
CH11IN
  Top 0.254: 15.24,16.51 IC5.5 JP1.12
CH12
  Top 0.254: IC6.2 19.05,16.51 18.87,16.33 IC6.1 18.41,16.51 17.94,16.99 17.94,22.86 16.63,24.17 IC11.8
CH12IN
  Top 0.254: JP1.13 18.89,11.27 18.89,14.76 19.68,15.56 IC6.3
CH13
  Top 0.254: IC11.9 17.13,24.3 19.05,22.38 IC6.13 19.05,21.59 18.87,21.77 IC6.14
CH13IN  (via drill 0.5)
  Top 0.254: IC6.12 19.68,20.95 v19.05,20.32
  Bottom 0.254: JP1.14 19.05,13.97 v19.05,20.32
CH14
  Top 0.254: IC6.8 22.23,21.59 22.05,21.77 IC6.9 21.59,26.73 IC11.18
CH14IN  (via drill 0.5)
  Top 0.254: IC6.10 20.95,20.95 v21.59,20.32
  Bottom 0.254: JP1.15 21.43,11.27 21.43,19.84 21.59,20 v21.59,20.32
CH15
  Top 0.254: 22.23,16.51 IC6.7 | IC6.6 22.05,16.33 22.23,16.51 | 22.23,16.51 22.7,16.99 22.7,22.38 22.13,22.95 IC11.19
CH15IN
  Top 0.254: IC6.5 20.95,13.34 JP1.16
CH16
  Top 0.254: IC7.2 IC7.1 23.65,16.81 23.65,23.34 22.63,24.36 IC11.20
CH16IN
  Top 0.254: JP1.17 23.97,11.27 23.97,14.13 25.4,15.56 IC7.3
CH17
  Top 0.254: IC11.21 23.13,24.65 24.77,23.02 IC7.13 IC7.14 24.75,21.77 24.77,21.75
CH17IN  (via drill 0.5)
  Top 0.254: IC7.12 25.4,20.95 v24.77,20.32
  Bottom 0.254: v24.77,20.32 24.77,14.76 22.86,12.86 JP1.18
CH18
  Top 0.254: IC7.8 IC7.9 27.3,22.23 26.83,22.7 25.72,22.7 23.63,24.79 IC11.22
CH18IN  (via drill 0.5)
  Top 0.254: IC7.10 26.67,20.95 v27.3,20.32
  Bottom 0.254: v27.3,20.32 27.3,15.08 26.51,14.29 26.51,11.27 JP1.19
CH19
  Top 0.254: IC7.6 IC7.7 28.42,16.81 28.42,22.38 27.62,23.18 25.88,23.18 24.13,24.92 IC11.23
CH19IN
  Top 0.254: IC7.5 26.67,13.97 JP1.20
CH20
  Top 0.254: IC8.2 IC8.1 29.37,16.81 29.37,23.02 28.73,23.65 26.04,23.65 24.63,25.06 IC11.24
CH20IN
  Top 0.254: IC8.3 31.11,15.56 29.05,13.49 29.05,11.27 JP1.21
CH21
  Top 0.254: IC8.14 IC8.13 30.48,22.54 29.84,23.18 28.89,24.13 26.19,24.13 25.13,25.19 IC11.25
CH21IN  (via drill 0.5)
  Top 0.254: IC8.12 31.11,20.95 v30.48,20.32
  Bottom 0.254: v30.48,20.32 30.48,15.4 27.94,12.86 JP1.22
CH22  (via drill 0.5)
  Top 0.254: IC8.8 IC8.9 33.02,22.23 32.54,22.7 30.96,22.7 28.73,24.92 v28.26,24.92
  Bottom 0.254: v28.26,24.92 27.78,25.4 J1.1
CH22IN  (via drill 0.5)
  Top 0.254: IC8.10 32.38,20.95 v33.02,20.32
  Bottom 0.254: JP1.23 31.59,11.27 31.59,14.61 33.02,16.03 v33.02,20.32
CH23  (via drill 0.5)
  Top 0.254: IC8.6 IC8.7 34.13,16.81 34.13,22.38 33.34,23.18 31.11,23.18 30.48,23.81 30,24.29 v28.26,26.04
  Bottom 0.254: v28.26,26.04 28.26,26.8 J2.1
CH23IN
  Top 0.254: IC8.5 32.38,14.61 JP1.24
CH24
  Top 0.254: IC9.2 IC9.1 35.56,16.35 35.08,16.83 35.08,22.38 35.4,22.7 35.4,23.81 27.84,31.37 IC11.32
CH24IN
  Top 0.254: JP1.25 34.13,11.27 34.13,13.49 35.08,14.45 35.56,14.45 36.83,15.72 IC9.3
CH25
  Top 0.254: IC9.14 IC9.13 36.2,23.65 27.98,31.87 IC11.33
CH25IN  (via drill 0.5)
  Top 0.254: IC9.12 36.83,20.95 v36.2,20.32
  Bottom 0.254: v36.2,20.32 36.2,16.03 33.34,13.18 33.34,13.02 JP1.26
CH26
  Top 0.254: IC9.8 IC9.9 38.73,22.23 38.42,22.54 37.94,22.54 35.08,25.4 | IC11.34 28.11,32.37 35.08,25.4 | 35.08,25.4
CH26IN  (via drill 0.5)
  Top 0.254: IC9.10 38.1,20.95 v38.73,20.32
  Bottom 0.254: JP1.27 36.67,11.27 36.67,13.97 38.73,16.03 v38.73,20.32
CH27
  Top 0.254: IC9.7 IC9.6 39.35,16.33 39.85,16.83 39.85,22.38 39.21,23.02 38.1,23.02 28.25,32.87 IC11.35
CH27IN
  Top 0.254: IC9.5 38.1,15.24 JP1.28
CH28
  Top 0.254: IC11.41 30.01,35.87 32.7,33.18 32.7,30.32 37.62,25.4 38.89,25.4 40.8,23.34 40.8,22.07 40.8,16.83 41.27,16.35 IC10.1 IC10.2
CH28IN
  Top 0.254: JP1.29 39.21,11.27 39.21,13.49 40.8,15.08 41.91,15.08 42.55,15.72 IC10.3
CH29
  Top 0.254: 30.15,36.37 IC11.42 | 30.15,36.37 | 30.15,36.37 33.18,33.34 33.18,30.48 37.78,25.88 39.05,25.88 41.91,22.86 IC10.13 IC10.14 41.27,22.23
CH29IN  (via drill 0.5)
  Top 0.254: IC10.12 42.55,20.95 v41.91,20.32
  Bottom 0.254: v41.91,20.32 41.91,16.51 JP1.30
CH30
  Top 0.254: IC10.8 IC10.9 44.45,22.23 39.85,26.83 39.85,29.69 35.08,34.45 32.7,34.45 30.28,36.87 IC11.43
CH30IN  (via drill 0.5)
  Top 0.254: IC10.10 43.81,20.95 v44.45,20.32
  Bottom 0.254: v44.45,20.32 44.45,13.97 JP1.31
CH31
  Top 0.254: IC10.6 IC10.7 45.09,19.37 45.56,19.82 45.56,22.38 45.24,22.7 44.61,22.7 40.32,26.99 40.32,29.84 35.4,34.77 | 35.4,34.77 | 35.4,34.77 35.24,34.92 32.86,34.92 30.42,37.37 IC11.44
CH31IN
  Top 0.254: IC10.5 43.81,15.4 41.12,12.7 JP1.32
D+
  Top 0.254: IC3.P$15 33.62,56.06 35.7,53.98 USB.3
D-
  Top 0.254: IC3.P$16 28.12,55.9 28.1,55.88 28.1,55.24 28.42,54.93 29.05,54.93 29.69,55.56 33.48,55.56 35.22,53.82 35.39,53.66 35.87,53.17 USB.2
DSPICA3V3  (via drill 0.5)
  Top 0.254: IC11.30 27.57,30.37 28.42,29.53 28.42,27.41 C17.2 | v36.99,28.1 38.58,28.1 | C6.1 31.43,24.23 v30.29,25.37 | v30.29,25.37 C17.2 | v30.29,25.37 C17.2
  Top 0.406: L2.1 38.73,27.3 38.73,28.1 38.58,28.1
  Bottom 0.254: v36.99,28.1 34.26,25.37 v30.29,25.37
FTDI3V3
  Top 0.254: C2.1 23.5,45.72 22.27,46.95 IC3.P$4 22.27,49.73 24.28,51.75 27.47,51.75 | 27.47,51.75 IC3.P$17 | 27.47,51.75 29.69,49.53 29.69,45.78 R2.1
FTDI_CTS  (via drill 0.5)
  Top 0.254: IC3.P$11 26.82,49.05 v27.62,49.85 | IC11.48 25.4,39.37 v25.08,39.69
  Bottom 0.254: v25.08,39.69 25.08,42.7 27.62,45.24 v27.62,49.85 | v27.62,49.85
FTDI_RTS  (via drill 0.5)
  Top 0.254: IC3.P$3 21.62,49.5 v21.27,49.85 | IC11.47 24.42,38.87 v24.13,38.58
  Bottom 0.254: v21.27,49.85 21.27,44.77 21.27,41.43 v24.13,38.58
FTDI_RX
  Top 0.254: IC11.51 25.13,43.29 24.45,43.97 24.45,46.35 24.13,46.67 23.34,46.67 22.92,47.09 IC3.P$5
FTDI_TX
  Top 0.254: IC11.52 24.63,43.16 20.32,47.47 IC3.P$1
GND  (via drill 0.5, 0.7, 1)
  Top 0.254: C11.2 18.52,24.45 18.73,24.45 20.13,25.84 IC11.15 20.13,28.29 v20,28.42 | C12.1 18.13,44.38 IC11.65 18.13,40.61 v18.41,40.32 | C14.2 29.12,33.37 IC11.36 25.43,33.37 v25.08,33.02 | C10.2 28.56,37.87 IC11.45 25.49,37.87 v25.08,37.47 | 21.62,55.91 21.59,55.88 v21.59,54.45 | 21.62,55.91 IC3.P$26 | IC3.P$25 21.77,56.06 21.62,55.91 | v24.29,49.85 24.22,49.62 IC3.P$7 24.22,47.53 25.4,46.35 25.4,46.04 25.08,45.72 C2.2 | C16.1 v8.89,40.64 | C1.2 23.6,58.32 24.87,57.05 IC3.P$21 24.87,54.72 v24.77,54.45 | v26.51,54.45 26.82,54.78 IC3.P$18 26.82,56.98 26.99,57.15 28.26,57.15 29.11,58 C3.2 | v4.45,33.02 5.08,33.02 5.6,33.54 LED1.C | C7.2 4.13,37.57 | 4.13,37.57 C13.2 5.66,37.62 | 4.13,37.57 v4.13,37.62 | S1.5 S1.4 S1.3 S1.2 | S1.2 6.46,46.3 6.35,46.2 6.72,46.2 S1.2 | S1.2 S1.1 2.59,46.3 v2.54,46.35 | C9.1 8.89,33.02 v7.62,33.02 | IC11.75 12.06,41.97 v12.06,41.91 | IC1.11 v3.17,20.32 | IC2.11 v8.89,20.32 | IC5.11 v14.61,20.32 | IC6.11 v20.32,20.32 | v10.79,27.46 10.79,26.51 10.79,26.67 C15.2 | IC7.11 v26.04,20.32 | IC8.11 v31.75,20.32 | IC9.11 v37.47,20.32 | IC10.11 v43.18,20.32 | 29.37,29.21 C17.1 29.53,28.16 C6.2 | IC11.31 27.71,30.87 29.37,29.21 | 29.37,29.21 29.37,28.26 31.91,25.72 | 31.91,25.72 | 31.91,25.72 v34.45,23.18
  Top 0.406: 36.83,55.56 36.84,55.58 USB.5
  Top 0.61: IC4.2 33.66,41.75 v34.29,42.55 34.92,41.75 IC4.3 | 36.83,55.56 38.73,55.56 v39.05,55.24 38.58,54.77 USB.4 | 33.66,48.9 IC4.7 34.87,45.78 34.92,45.72 IC4.6 | 33.66,48.9 C5.2 | 33.66,48.9 v34.92,50.16 | C4.- 40.16,34.91 v40.16,33.5 | C8.- 34.59,32.54 v35.72,32.54
  other vias: 17.78,33.66
  pour Bottom: 0,60.33 46.35,60.33 46.35,0 0,0 0,23.5 40.01,23.5 40.01,53.98 39.37,53.98 39.37,24.13 0,24.13
MCLR  (via drill 0.5, 1)
  Top 0.254: v26.67,41.91 R1.2 | IC11.13 19.13,29.13 v19.05,29.21 15.24,33.02 v15.24,33.66
  Bottom 0.254: v26.67,41.91 26.67,36.83 v19.05,29.21
N$2
  Top 0.61: USB.1 35.73,52.38 33.66,54.45 33.18,54.45 33.17,54.44 F1.1
N$3
  Top 0.254: 5.71,34.92 LED1.A 5.62,35.14 R8.2
N$15
  Top 0.254: IC11.85 10.59,35.87 C16.2
N$17
  Top 0.254: IC11.74 13.63,43.04 13.49,43.18 8.06,43.18 XT1.P$2 5.71,40.84 C13.1
N$18
  Top 0.254: IC11.73 14.13,43.5 13.65,43.97 6.35,43.97 XT1.P$1 2.54,40.16 C7.1
PGEC1  (via drill 0.5, 1)
  Top 0.254: IC11.26 25.13,28.37 v24.92,28.57 20.32,33.18 v20.32,33.66
  Bottom 0.254: v24.92,28.57 24.92,26.54 J1.2
PGED1  (via drill 0.5, 1)
  Top 0.254: IC11.27 26.71,28.89 25.88,28.89 24.92,29.84 v24.92,30.16 24.92,31.11 20.48,35.56 v19.05,35.56
  Bottom 0.254: v24.92,30.16 26.22,28.87 J2.2
PWREN
  Top 0.254: IC3.P$14 28.77,46.87 28.1,46.2 R2.2 28.26,45.56 28.2,45.51 28.2,45.09 29.15,44.13 31.75,44.13 31.91,43.97 35.72,43.97 36.04,44.29 36.2,44.45 IC4.5

### Text on the board
_tsilk: NUM CHAN SELECT | POWER | DAQ32 | SOHM | 1 | 3 | 5 | 7 | 9 | 11 | 13 | 15 | 17 | 19 | 21 | 23 | 25 | 27 | 29 | 31 | CHAN | 0 | 2 | 4 | 6 | 8 | 10 | 12 | 14 | 16 | 18 | 20 | 22 | 24 | 26 | 28 | 30 | 3.3V | GND
_bsilk: VDD | PGED1 | MCLR | GND | PGEC1